# Altium schematic sheet encoder.schdoc: ENC
size A4; Date: 10.28.2025; CheckedBy: BCY; DrawnBy: miaow; DocumentNumber: 10; Revision: v1.0.0; SheetNumber: 10; SheetTotal: 14; BoardType: MAIN_PCB; Desc: Encoder interface
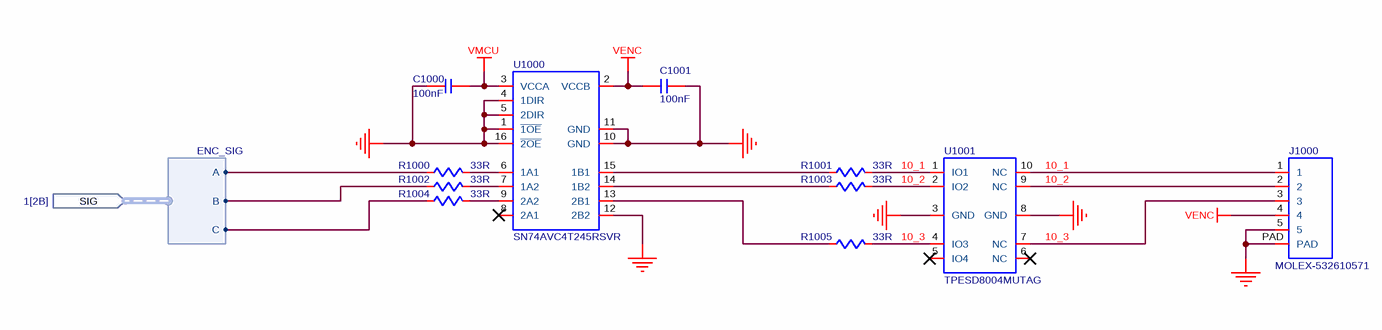
[diagram p0: encoder.schdoc]

## Parts
C1000  value 100nF  [C0402]  (hidden comment: C-NOMO)
C1001  value 100nF  [C0402]  (hidden comment: C-NOMO)
J1000  MOLEX-532610571  [MOLEX-532610571]
R1000  value 33R  [R0402]  (hidden comment: R)
R1001  value 33R  [R0402]  (hidden comment: R)
R1002  value 33R  [R0402]  (hidden comment: R)
R1003  value 33R  [R0402]  (hidden comment: R)
R1004  value 33R  [R0402]  (hidden comment: R)
R1005  value 33R  [R0402]  (hidden comment: R)
U1000  SN74AVC4T245RSVR  [SN74AVC4T245RSVR]
U1001  TPESD8004MUTAG  [TPESD8004MUTAG]

## Ports
SIG (in, harness ENC_SIG, see 1[2B])

## Harnesses
ENC_SIG: A, B, C

## Nets
GND: C1000.1 C1001.2 J1000.5 J1000.PAD U1000.1(~{1OE}) U1000.4(1DIR) U1000.5(2DIR) U1000.10(GND) U1000.11(GND) U1000.12(2B2) U1000.16(~{2OE}) U1001.3(GND) U1001.8(GND)
VENC: C1001.1 J1000.4 U1000.2(VCCB)
VMCU: C1000.2 U1000.3(VCCA)
10_1: J1000.1 R1001.2 U1001.1(IO1) U1001.10(NC)
10_2: J1000.2 R1003.2 U1001.2(IO2) U1001.9(NC)
10_3: J1000.3 R1005.2 U1001.4(IO3) U1001.7(NC)
NetR1000_1: R1000.1 ; port SIG.A
NetR1000_2: R1000.2 U1000.6(1A1)
NetR1001_1: R1001.1 U1000.15(1B1)
NetR1002_1: R1002.1 ; port SIG.B
NetR1002_2: R1002.2 U1000.7(1A2)
NetR1003_1: R1003.1 U1000.14(1B2)
NetR1004_1: R1004.1 ; port SIG.C
NetR1004_2: R1004.2 U1000.9(2A2)
NetR1005_1: R1005.1 U1000.13(2B1)

Not connected (* = marked no-connect by the designer): U1000 8(2A1)*; U1001 5(IO4)* 6(NC)*

## Notes on the sheet
- DRAWN
- CHECKED
- DRAWNBY
- SHEETS
- SHEETS_NO

## Library data of the parts
C1000 C1001 = C-NOMO: voltage: 25V; precision: 5%
J1000 = MOLEX-532610571: HEADER - 1.25 - 5p; Supplier 1: LCSC; Supplier Part Number 1: C668616; Supplier 2: LCSC; Supplier Part Number 2: C17256390
R1000-R1005 = R: precision: 1%
U1000 = SN74AVC4T245RSVR: LEVEL SHIFT - 4bits, 2grps, 1.2V - 3.6V, 380Mbps; Supplier 1: LCSC; Supplier Part Number 1: C133244
U1001 = TPESD8004MUTAG: TVS/ESD; Supplier 1: LCSC; Supplier Part Number 1: C2827679